# EAGLE design skatemate_proto (EAGLE 7.6.0)

## Sheet 1 of 3
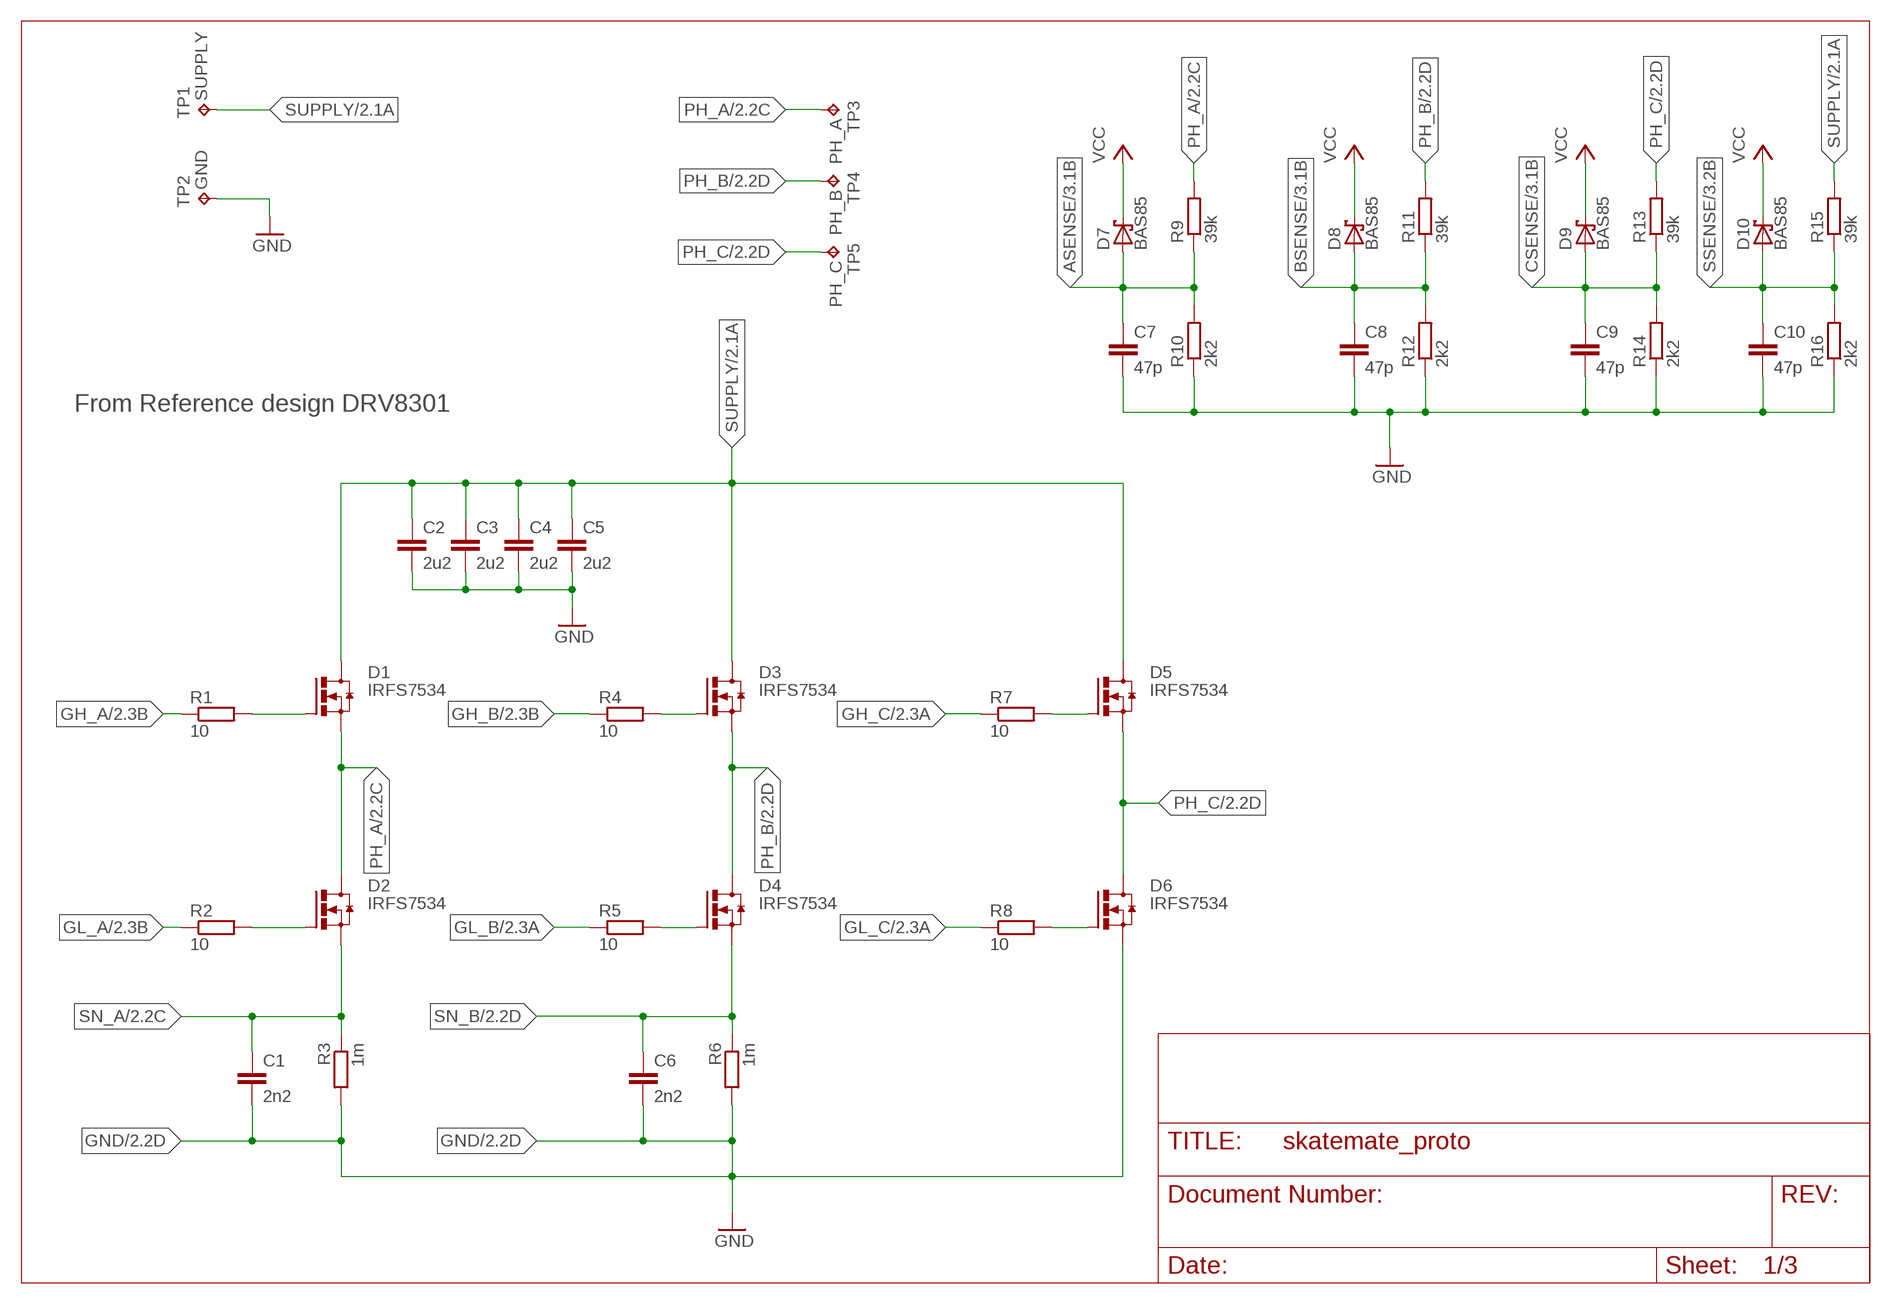
[diagram p0: schematic, sheet 1]

### Parts
C1  2n2  C-EUC0805  [C0805]
C2  2u2  C-EUC1206  [C1206]
C3  2u2  C-EUC1206  [C1206]
C4  2u2  C-EUC1206  [C1206]
C5  2u2  C-EUC1206  [C1206]
C6  2n2  C-EUC0805  [C0805]
C7  47p  C-EUC0805  [C0805]
C8  47p  C-EUC0805  [C0805]
C9  47p  C-EUC0805  [C0805]
C10  47p  C-EUC0805  [C0805]
D1  IRFS7534  [D2PAK-7]
D2  IRFS7534  [D2PAK-7]
D3  IRFS7534  [D2PAK-7]
D4  IRFS7534  [D2PAK-7]
D5  IRFS7534  [D2PAK-7]
D6  IRFS7534  [D2PAK-7]
D7  BAS85  SCHOTTKY-DIODESOD80C  [SOD80C]
D8  BAS85  SCHOTTKY-DIODESOD80C  [SOD80C]
D9  BAS85  SCHOTTKY-DIODESOD80C  [SOD80C]
D10  BAS85  SCHOTTKY-DIODESOD80C  [SOD80C]
R1  10  R-EU_R0805  [R0805]
R2  10  R-EU_R0805  [R0805]
R3  1m  R_EU  [R2512]
R4  10  R-EU_R0805  [R0805]
R5  10  R-EU_R0805  [R0805]
R6  1m  R_EU  [R2512]
R7  10  R-EU_R0805  [R0805]
R8  10  R-EU_R0805  [R0805]
R9  39k  R-EU_R0805  [R0805]
R10  2k2  R-EU_R0805  [R0805]
R11  39k  R-EU_R0805  [R0805]
R12  2k2  R-EU_R0805  [R0805]
R13  39k  R-EU_R0805  [R0805]
R14  2k2  R-EU_R0805  [R0805]
R15  39k  R-EU_R0805  [R0805]
R16  2k2  R-EU_R0805  [R0805]
TP1  SUPPLY  TPSMD_M_1006  [SMD_M_1006]
TP2  GND  TPSMD_M_1006  [SMD_M_1006]
TP3  PH_A  TPSMD_M_1006  [SMD_M_1006]
TP4  PH_B  TPSMD_M_1006  [SMD_M_1006]
TP5  PH_C  TPSMD_M_1006  [SMD_M_1006]

### Nets
ASENSE: C7.1 D7.A R9.1 R10.2 ; also sheet 3
BSENSE: C8.1 D8.A R11.1 R12.2 ; also sheet 3
CSENSE: C9.1 D9.A R13.1 R14.2 ; also sheet 3
GH_A: R1.1 ; also sheet 2
GH_B: R4.1 ; also sheet 2
GH_C: R7.1 ; also sheet 2
GL_A: R2.1 ; also sheet 2
GL_B: R5.1 ; also sheet 2
GL_C: R8.1 ; also sheet 2
GND: C1.2 C2.2 C3.2 C4.2 C5.2 C6.2 C7.2 C8.2 C9.2 C10.2 D6.S1(S) D6.S2(S) D6.S3(S) D6.S4(S) D6.S5(S) R3.2 R6.2 R10.1 R12.1 R14.1 R16.1 TP2.P$1(TP) ; also sheet 2,3
N$7: D1.G R1.2
N$8: D2.G R2.2
N$9: D4.G R5.2
N$10: D3.G R4.2
N$11: D5.G R7.2
N$12: D6.G R8.2
PH_A: D1.S1(S) D1.S2(S) D1.S3(S) D1.S4(S) D1.S5(S) D2.D R9.2 TP3.P$1(TP) ; also sheet 2
PH_B: D3.S1(S) D3.S2(S) D3.S3(S) D3.S4(S) D3.S5(S) D4.D R11.2 TP4.P$1(TP) ; also sheet 2
PH_C: D5.S1(S) D5.S2(S) D5.S3(S) D5.S4(S) D5.S5(S) D6.D R13.2 TP5.P$1(TP) ; also sheet 2
SN_A: C1.1 D2.S1(S) D2.S2(S) D2.S3(S) D2.S4(S) D2.S5(S) R3.1 ; also sheet 2
SN_B: C6.1 D4.S1(S) D4.S2(S) D4.S3(S) D4.S4(S) D4.S5(S) R6.1 ; also sheet 2
SSENSE: C10.1 D10.A R15.1 R16.2 ; also sheet 3
SUPPLY: C2.1 C3.1 C4.1 C5.1 D1.D D3.D D5.D R15.2 TP1.P$1(TP) ; also sheet 2
VCC: D7.C D8.C D9.C D10.C ; also sheet 2,3

### Notes on the sheet
- From Reference design DRV8301

## Sheet 2 of 3
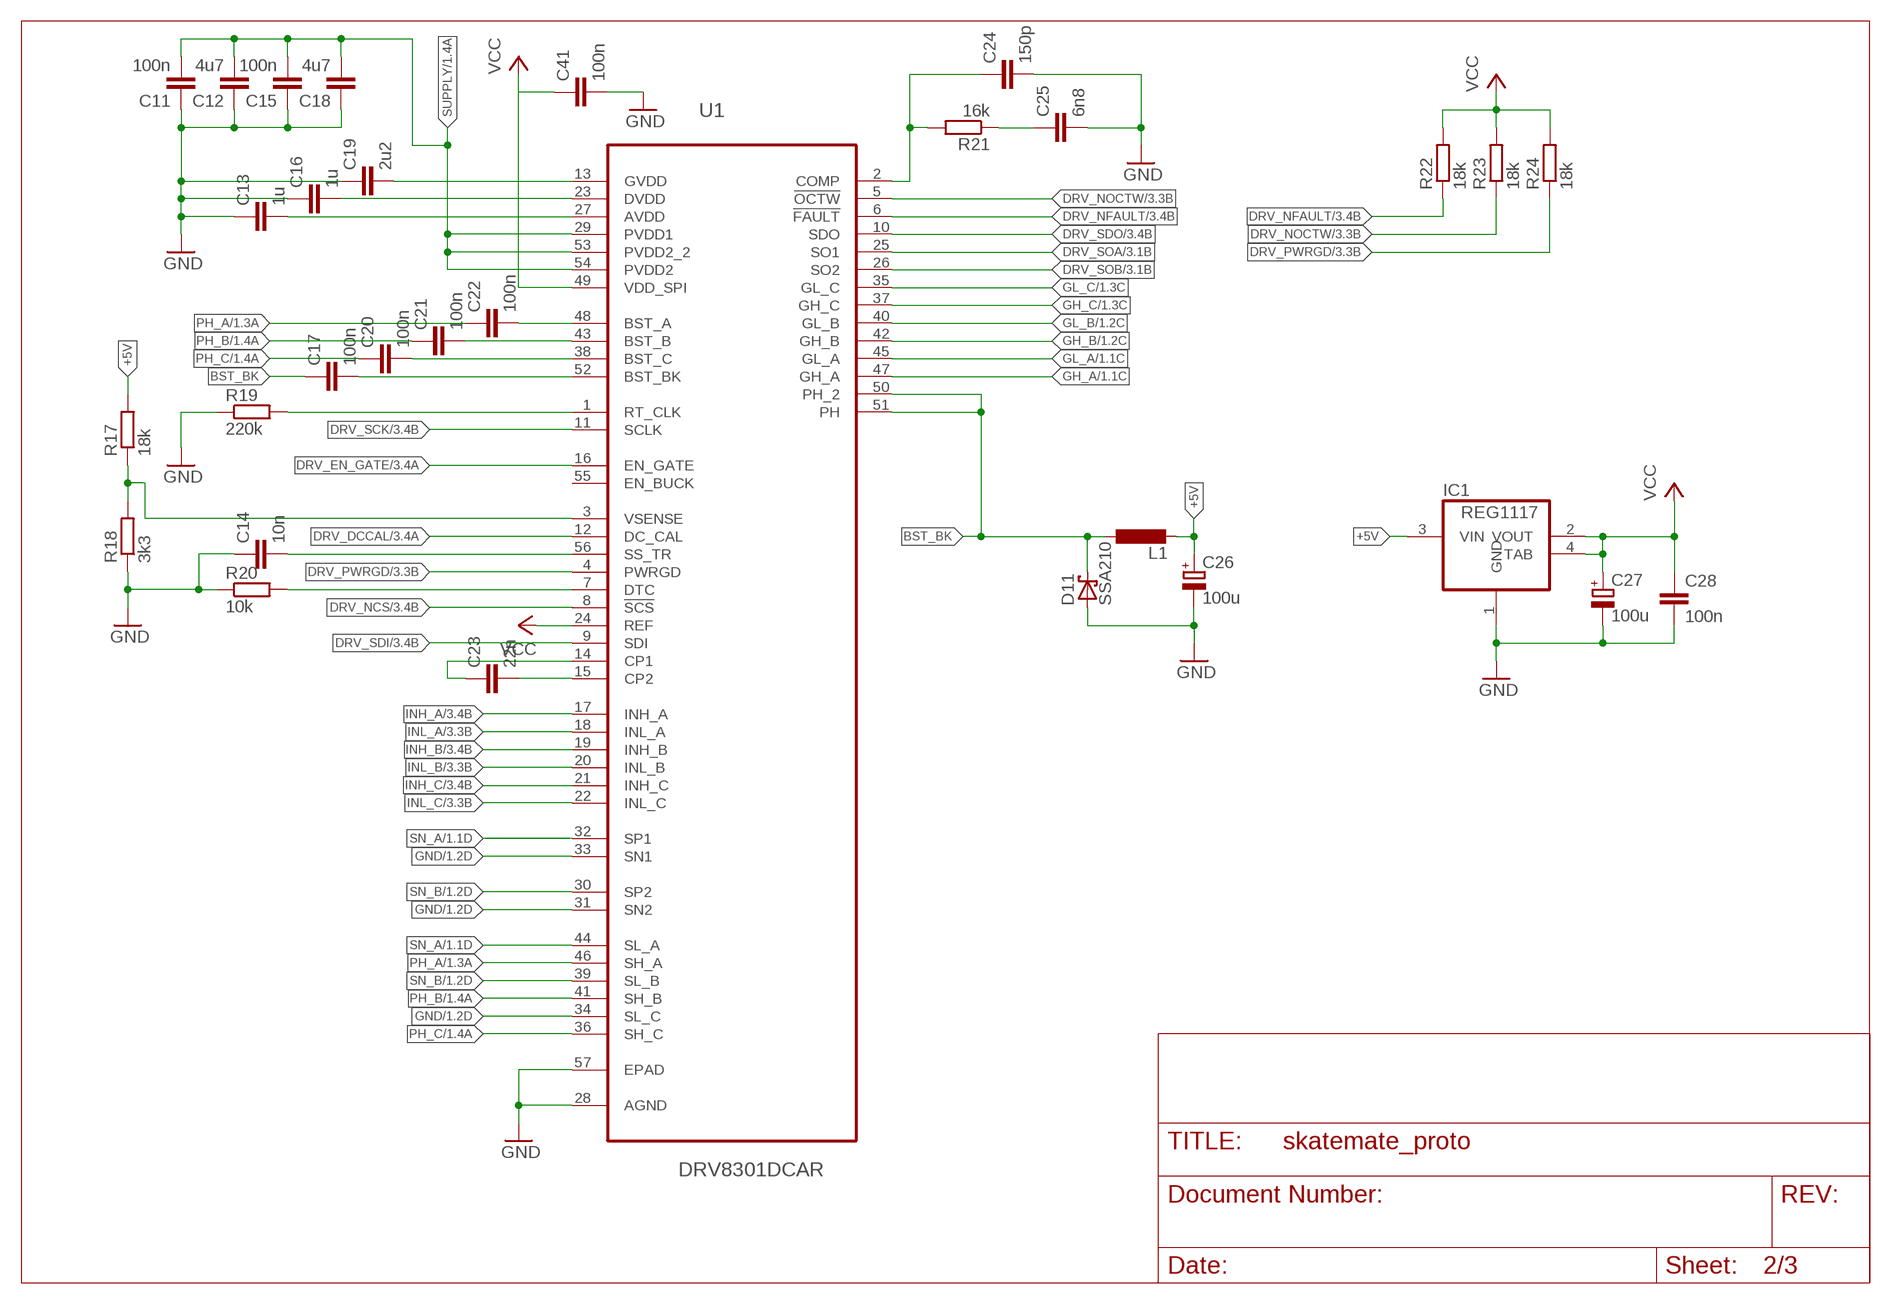
[diagram p1: schematic, sheet 2]

### Parts
C11  100n  C-EUC0805  [C0805]
C12  4u7  C-EUC1206  [C1206]
C13  1u  C-EUC1206  [C1206]
C14  10n  C-EUC0805  [C0805]
C15  100n  C-EUC0805  [C0805]
C16  1u  C-EUC1206  [C1206]
C17  100n  C-EUC0805  [C0805]
C18  4u7  C-EUC1206  [C1206]
C19  2u2  C-EUC1206  [C1206]
C20  100n  C-EUC0805  [C0805]
C21  100n  C-EUC0805  [C0805]
C22  100n  C-EUC0805  [C0805]
C23  22n  C-EUC0805  [C0805]
C24  150p  C-EUC0805  [C0805]
C25  6n8  C-EUC0805  [C0805]
C26  100u  CPOL-EUB/3528-21W  [B/3528-21W]
C27  100u  CPOL-EUB/3528-21W  [B/3528-21W]
C28  100n  C-EUC0805  [C0805]
C41  100n  C-EUC0805  [C0805]
D11  SSA210  SCHOTTKY-DIODEDO-214AA  [DO-214AA]
IC1  REG1117  [SOT223]
L1  L-EUSDR0805  [SDR0805]
R17  18k  R-EU_R0805  [R0805]
R18  3k3  R-EU_R0805  [R0805]
R19  220k  R-EU_R0805  [R0805]
R20  10k  R-EU_R0805  [R0805]
R21  16k  R-EU_R0805  [R0805]
R22  18k  R-EU_R0805  [R0805]
R23  18k  R-EU_R0805  [R0805]
R24  18k  R-EU_R0805  [R0805]
U1  DRV8301DCAR  [SOP50P810X120-57N]

### Nets
+5V: C26.+ IC1.3(VIN) L1.2 R17.2
BST_BK: C17.1 D11.C L1.1 U1.50(PH_2) U1.51(PH)
DRV_DCCAL: U1.12(DC_CAL) ; also sheet 3
DRV_EN_GATE: U1.16(EN_GATE) ; also sheet 3
DRV_NCS: U1.8(!SCS) ; also sheet 3
DRV_NFAULT: R22.1 U1.6(!FAULT) ; also sheet 3
DRV_NOCTW: R23.1 U1.5(!OCTW) ; also sheet 3
DRV_PWRGD: R24.1 U1.4(PWRGD) ; also sheet 3
DRV_SCK: U1.11(SCLK) ; also sheet 3
DRV_SDI: U1.9(SDI) ; also sheet 3
DRV_SDO: U1.10(SDO) ; also sheet 3
DRV_SOA: U1.25(SO1) ; also sheet 3
DRV_SOB: U1.26(SO2) ; also sheet 3
GH_A: U1.47(GH_A) ; also sheet 1
GH_B: U1.42(GH_B) ; also sheet 1
GH_C: U1.37(GH_C) ; also sheet 1
GL_A: U1.45(GL_A) ; also sheet 1
GL_B: U1.40(GL_B) ; also sheet 1
GL_C: U1.35(GL_C) ; also sheet 1
GND: C11.1 C12.1 C13.1 C14.1 C15.1 C16.1 C18.1 C19.1 C24.2 C25.2 C26.- C27.- C28.2 C41.2 D11.A IC1.1(GND) R18.1 R19.1 R20.1 U1.28(AGND) U1.31(SN2) U1.33(SN1) U1.34(SL_C) U1.57(EPAD) ; also sheet 1,3
INH_A: U1.17(INH_A) ; also sheet 3
INH_B: U1.19(INH_B) ; also sheet 3
INH_C: U1.21(INH_C) ; also sheet 3
INL_A: U1.18(INL_A) ; also sheet 3
INL_B: U1.20(INL_B) ; also sheet 3
INL_C: U1.22(INL_C) ; also sheet 3
N$1: C23.2 U1.15(CP2)
N$2: C23.1 U1.14(CP1)
N$3: R20.2 U1.7(DTC)
N$4: R17.1 R18.2 U1.3(VSENSE)
N$5: C14.2 U1.56(SS_TR)
N$6: R19.2 U1.1(RT_CLK)
N$13: C22.2 U1.48(BST_A)
N$14: C21.2 U1.43(BST_B)
N$15: C20.2 U1.38(BST_C)
N$16: C17.2 U1.52(BST_BK)
N$17: C19.2 U1.13(GVDD)
N$18: C16.2 U1.23(DVDD)
N$19: C13.2 U1.27(AVDD)
N$20: C24.1 R21.2 U1.2(COMP)
N$21: C25.1 R21.1
PH_A: C22.1 U1.46(SH_A) ; also sheet 1
PH_B: C21.1 U1.41(SH_B) ; also sheet 1
PH_C: C20.1 U1.36(SH_C) ; also sheet 1
SN_A: U1.32(SP1) U1.44(SL_A) ; also sheet 1
SN_B: U1.30(SP2) U1.39(SL_B) ; also sheet 1
SUPPLY: C11.2 C12.2 C15.2 C18.2 U1.29(PVDD1) U1.53(PVDD2_2) U1.54(PVDD2) ; also sheet 1
VCC: C27.+ C28.1 C41.1 IC1.2(VOUT) IC1.4(TAB) R22.2 R23.2 R24.2 U1.24(REF) U1.49(VDD_SPI) ; also sheet 1,3
Unconnected: U1.55(EN_BUCK)

## Sheet 3 of 3
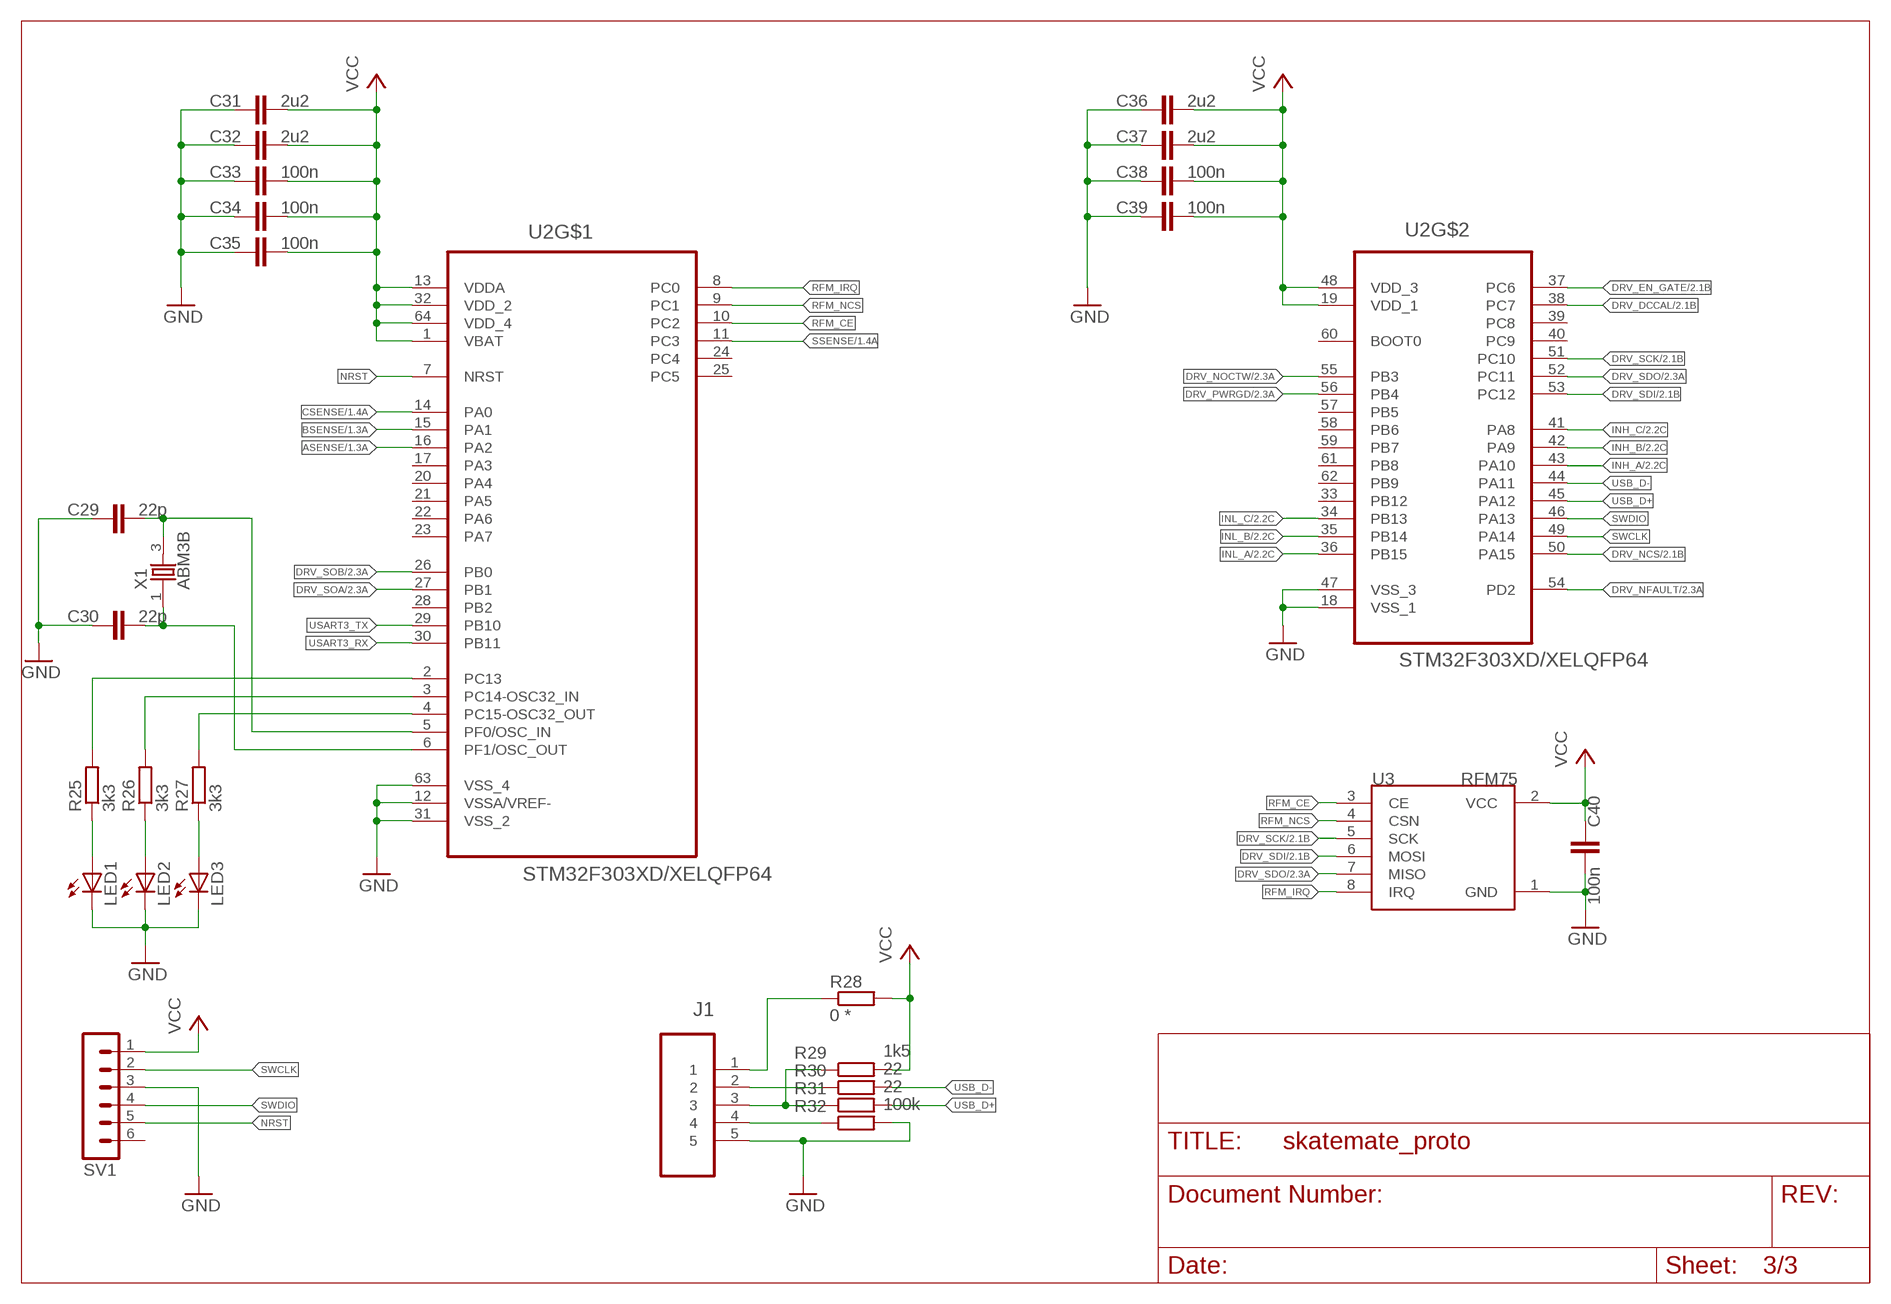
[diagram p2: schematic, sheet 3]

### Parts
C29  22p  C-EUC0805  [C0805]
C30  22p  C-EUC0805  [C0805]
C31  2u2  C-EUC0805  [C0805]
C32  2u2  C-EUC0805  [C0805]
C33  100n  C-EUC0805  [C0805]
C34  100n  C-EUC0805  [C0805]
C35  100n  C-EUC0805  [C0805]
C36  2u2  C-EUC0805  [C0805]
C37  2u2  C-EUC0805  [C0805]
C38  100n  C-EUC0805  [C0805]
C39  100n  C-EUC0805  [C0805]
C40  100n  C-EUC0805  [C0805]
J1  47346-0001  [MOLEX_47346-0001]
LED1  LEDCHIP-LED0805  [CHIP-LED0805]
LED2  LEDCHIP-LED0805  [CHIP-LED0805]
LED3  LEDCHIP-LED0805  [CHIP-LED0805]
R25  3k3  R-EU_R0805  [R0805]
R26  3k3  R-EU_R0805  [R0805]
R27  3k3  R-EU_R0805  [R0805]
R28  0 *  R-EU_R0805  [R0805]
R29  1k5  R-EU_R0805  [R0805]
R30  22  R-EU_R0805  [R0805]
R31  22  R-EU_R0805  [R0805]
R32  100k  R-EU_R0805  [R0805]
SV1  MA06-1  [MA06-1]
U2  STM32F303XD/XELQFP64  [LQFP64]
U3  RFM75  [RFM75]
X1  ABM3B  [IQG5032B]

### Nets
ASENSE: U2.16(PA2) ; also sheet 1
BSENSE: U2.15(PA1) ; also sheet 1
CSENSE: U2.14(PA0) ; also sheet 1
DRV_DCCAL: U2.38(PC7) ; also sheet 2
DRV_EN_GATE: U2.37(PC6) ; also sheet 2
DRV_NCS: U2.50(PA15) ; also sheet 2
DRV_NFAULT: U2.54(PD2) ; also sheet 2
DRV_NOCTW: U2.55(PB3) ; also sheet 2
DRV_PWRGD: U2.56(PB4) ; also sheet 2
DRV_SCK: U2.51(PC10) U3.5(SCK) ; also sheet 2
DRV_SDI: U2.53(PC12) U3.6(MOSI) ; also sheet 2
DRV_SDO: U2.52(PC11) U3.7(MISO) ; also sheet 2
DRV_SOA: U2.27(PB1) ; also sheet 2
DRV_SOB: U2.26(PB0) ; also sheet 2
GND: C29.1 C30.1 C31.1 C32.1 C33.1 C34.1 C35.1 C36.1 C37.1 C38.1 C39.1 C40.2 J1.5 LED1.C LED2.C LED3.C R32.2 SV1.3 U2.12(VSSA/VREF-) U2.18(VSS_1) U2.31(VSS_2) U2.47(VSS_3) U2.63(VSS_4) U3.1(GND) ; also sheet 1,2
INH_A: U2.43(PA10) ; also sheet 2
INH_B: U2.42(PA9) ; also sheet 2
INH_C: U2.41(PA8) ; also sheet 2
INL_A: U2.36(PB15) ; also sheet 2
INL_B: U2.35(PB14) ; also sheet 2
INL_C: U2.34(PB13) ; also sheet 2
N$22: J1.4 R32.1
N$23: J1.3 R29.1 R31.1
N$24: J1.2 R30.1
N$25: J1.1 R28.1
N$28: R27.2 U2.4(PC15-OSC32_OUT)
N$29: R26.2 U2.3(PC14-OSC32_IN)
N$30: R25.2 U2.2(PC13)
N$31: LED1.A R25.1
N$32: LED2.A R26.1
N$33: LED3.A R27.1
N$35: C30.2 U2.6(PF1/OSC_OUT) X1.1
N$36: C29.2 U2.5(PF0/OSC_IN) X1.3
NRST: SV1.5 U2.7(NRST)
RFM_CE: U2.10(PC2) U3.3(CE)
RFM_IRQ: U2.8(PC0) U3.8(IRQ)
RFM_NCS: U2.9(PC1) U3.4(CSN)
SSENSE: U2.11(PC3) ; also sheet 1
SWCLK: SV1.2 U2.49(PA14)
SWDIO: SV1.4 U2.46(PA13)
USART3_RX: U2.30(PB11)
USART3_TX: U2.29(PB10)
USB_D+: R31.2 U2.45(PA12)
USB_D-: R30.2 U2.44(PA11)
VCC: C31.2 C32.2 C33.2 C34.2 C35.2 C36.2 C37.2 C38.2 C39.2 C40.1 R28.2 R29.2 SV1.1 U2.1(VBAT) U2.13(VDDA) U2.19(VDD_1) U2.32(VDD_2) U2.48(VDD_3) U2.64(VDD_4) U3.2(VCC) ; also sheet 1,2
Unconnected: SV1.6 U2.17(PA3) U2.20(PA4) U2.21(PA5) U2.22(PA6) U2.23(PA7) U2.24(PC4) U2.25(PC5) U2.28(PB2) U2.33(PB12) U2.39(PC8) U2.40(PC9) U2.57(PB5) U2.58(PB6) U2.59(PB7) U2.60(BOOT0) U2.61(PB8) U2.62(PB9)

## Library data of the parts
C1-C25 C28-C41 = skatemate:C-EU: CAPACITOR, European symbol
C26 C27 = skatemate:CPOL-EU: POLARIZED CAPACITOR, European symbol
D1-D6 = skatemate:IRFS7534
D7-D11 = skatemate:SCHOTTKY-DIODE: Schottky Diode
IC1 = skatemate:REG1117: 800mA and 1A Low Dropout (LDO) Positive Regulator 1.8V, 2.5V, 2.85V, 3.3V, 5V, and Adj; MPN: REG1117; OC_FARNELL: 1097566; OC_NEWARK: 14P6981
J1 = skatemate:47346-0001: CONN RCPT 5POS MICRO USB R/A SMD; MPN: 47346-0001; OC_FARNELL: 1568026; OC_NEWARK: 47M0505; PACKAGE: 5 POS MICRO USB R/A; SUPPLIER: MOLEX
L1 = skatemate:L-EU: INDUCTOR, European symbol
LED1-LED3 = skatemate:LED: LED OSRAM: - CHIPLED LG R971, LG N971, LY N971, LG Q971, LY Q971, LO R971, LY R971 LH N974, LH R974 LS Q976, LO Q976, LY Q976 LO Q996 - Hyper CHIPLED LW Q18S LB Q993, LB Q99A, LB R99A - SideLED LS A670, LO A670, LY A670, LG A670, LP A670 LB A673, LV A673, LT A673, LW A673 LH A674 LY A675 LS A676, LA A676, LO A676, LY A676, LW A676 LS A679, LY A679, LG A679 - Hyper Micro SIDELED® LS Y876, LA Y876, LO Y876, LY Y876 LT Y87S - SmartLED LW L88C, LW L88S LB L89C, LB L89S, LG L890 LS L89K, LO L89K, LY L89K LS L896, LA L896, LO L896, LY L896 - TOPLED LS T670, LO T670, LY T670, LG T670, LP T670 LSG T670, LSP T670, LSY T670, LOP T670, LYG T670 LG T671, LOG T671, LSG T671 LB T673, LV T673, LT T673, LW T673 LH T674 LS T676, LA T676, LO T676, LY T676, LB T676, LH T676, LSB T676, LW T676 LB T67C, LV T67C, LT T67C, LS T67K, LO T67K, LY T67K, LW E67C LS E67B, LA E67B, LO E67B, LY E67B, LB E67C, LV E67C, LT E67C LW T67C LS T679, LY T679, LG T679 LS T770, LO T770, LY T770, LG T770, LP T770 LB T773, LV T773, LT T773, LW T773 LH T774 LS E675, LA E675, LY E675, LS T675 LS T776, LA T776, LO T776, LY T776, LB T776 LHGB T686 LT T68C, LB T68C - Hyper Mini TOPLED® LB M676 - Mini TOPLED Santana® LG M470 LS M47K, LO M47K, LY M47K Source: http://www.osram.convergy.de LUXEON: - LUMILED® LXK2-PW12-R00, LXK2-PW12-S00, LXK2-PW14-U00, LXK2-PW14-V00 LXK2-PM12-R00, LXK2-PM12-S00, LXK2-PM14-U00 LXK2-PE12-Q00, LXK2-PE12-R00, LXK2-PE12-S00, LXK2-PE14-T00, LXK2-PE14-U00 LXK2-PB12-K00, LXK2-PB12-L00, LXK2-PB12-M00, LXK2-PB14-N00, LXK2-PB14-P00, LXK2-PB14-Q00 LXK2-PR12-L00, LXK2-PR12-M00, LXK2-PR14-Q00, LXK2-PR14-R00 LXK2-PD12-Q00, LXK2-PD12-R00, LXK2-PD12-S00 LXK2-PH12-R00, LXK2-PH12-S00 LXK2-PL12-P00, LXK2-PL12-Q00, LXK2-PL12-R00 Source: www.luxeon.com KINGBRIGHT: KA-3528ASYC Source: www.kingbright.com
R1 R2 R4 R5 R7-R32 = skatemate:R-EU_: RESISTOR, European symbol
R3 R6 = skatemate:R_EU
SV1 = skatemate:MA06-1: PIN HEADER; OC_FARNELL: unknown; OC_NEWARK: unknown
TP1-TP5 = skatemate:TP: Test pad
U1 = skatemate:DRV8301DCAR: Three Phase Pre-Driver with Dual Current Shunt Amplifiers and Buck Regulator,HTSSOP-56; MPN: DRV8301DCAR; OC_FARNELL: 2045285; OC_NEWARK: 64T2938; PACKAGE: HTSSOP-56; SUPPLIER: TEXAS INSTRUMENTS
U2 = skatemate:STM32F303XD/XE
U3 = skatemate:RFM75
X1 = skatemate:ABM3B

## Board
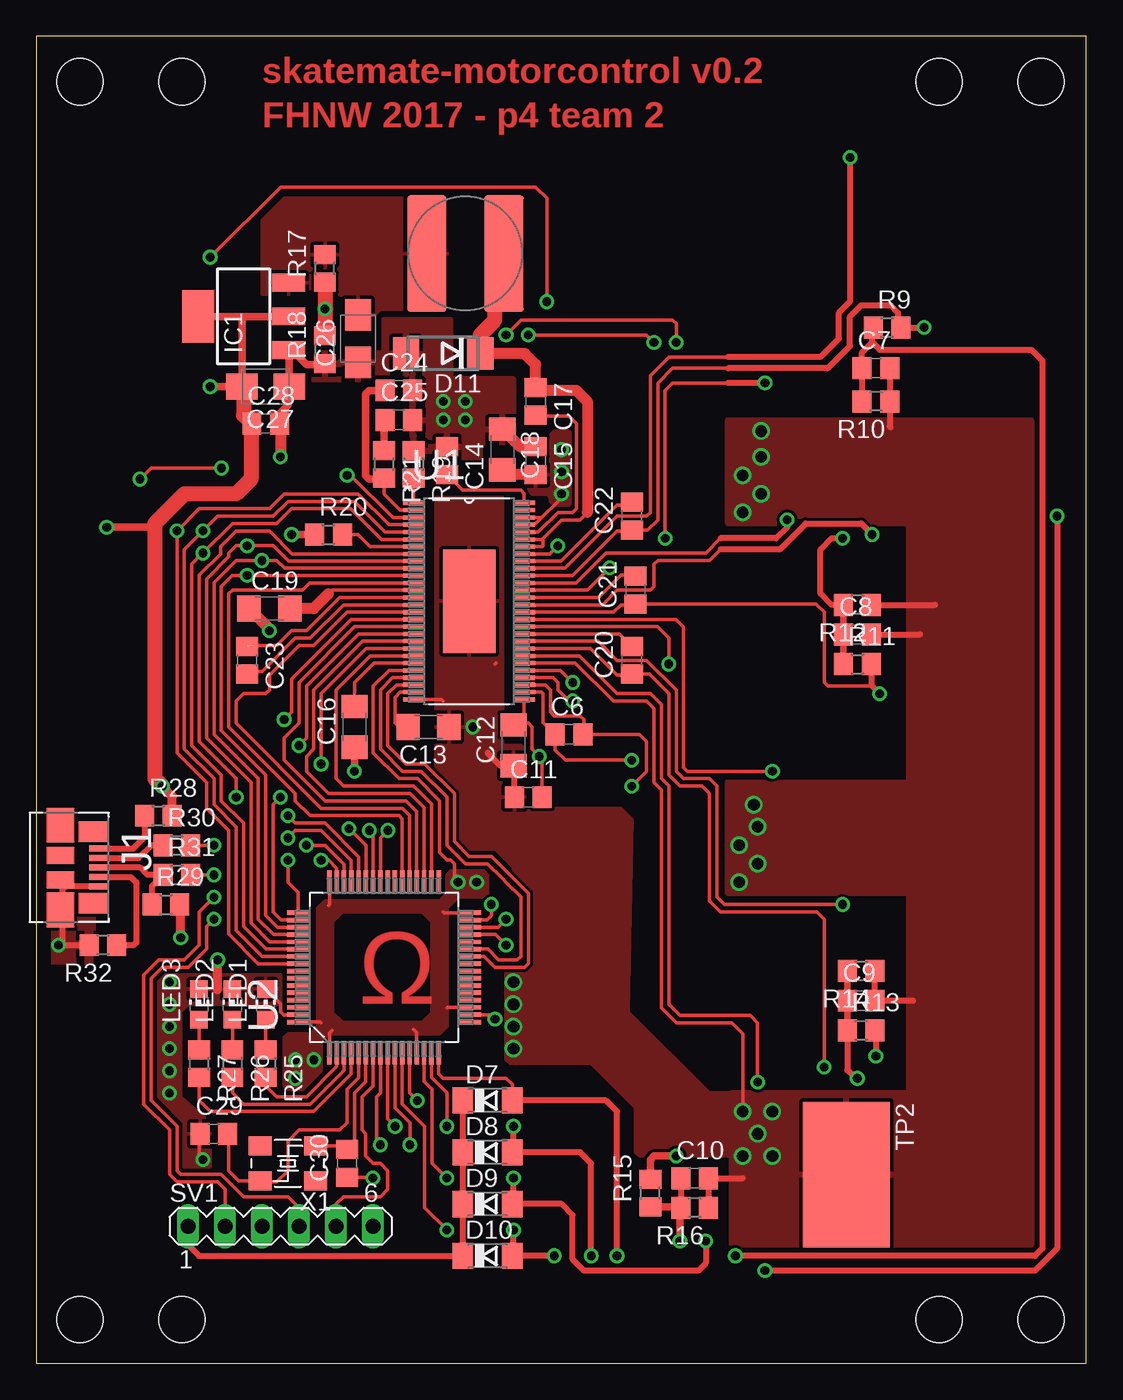
[diagram p3: board, top side]
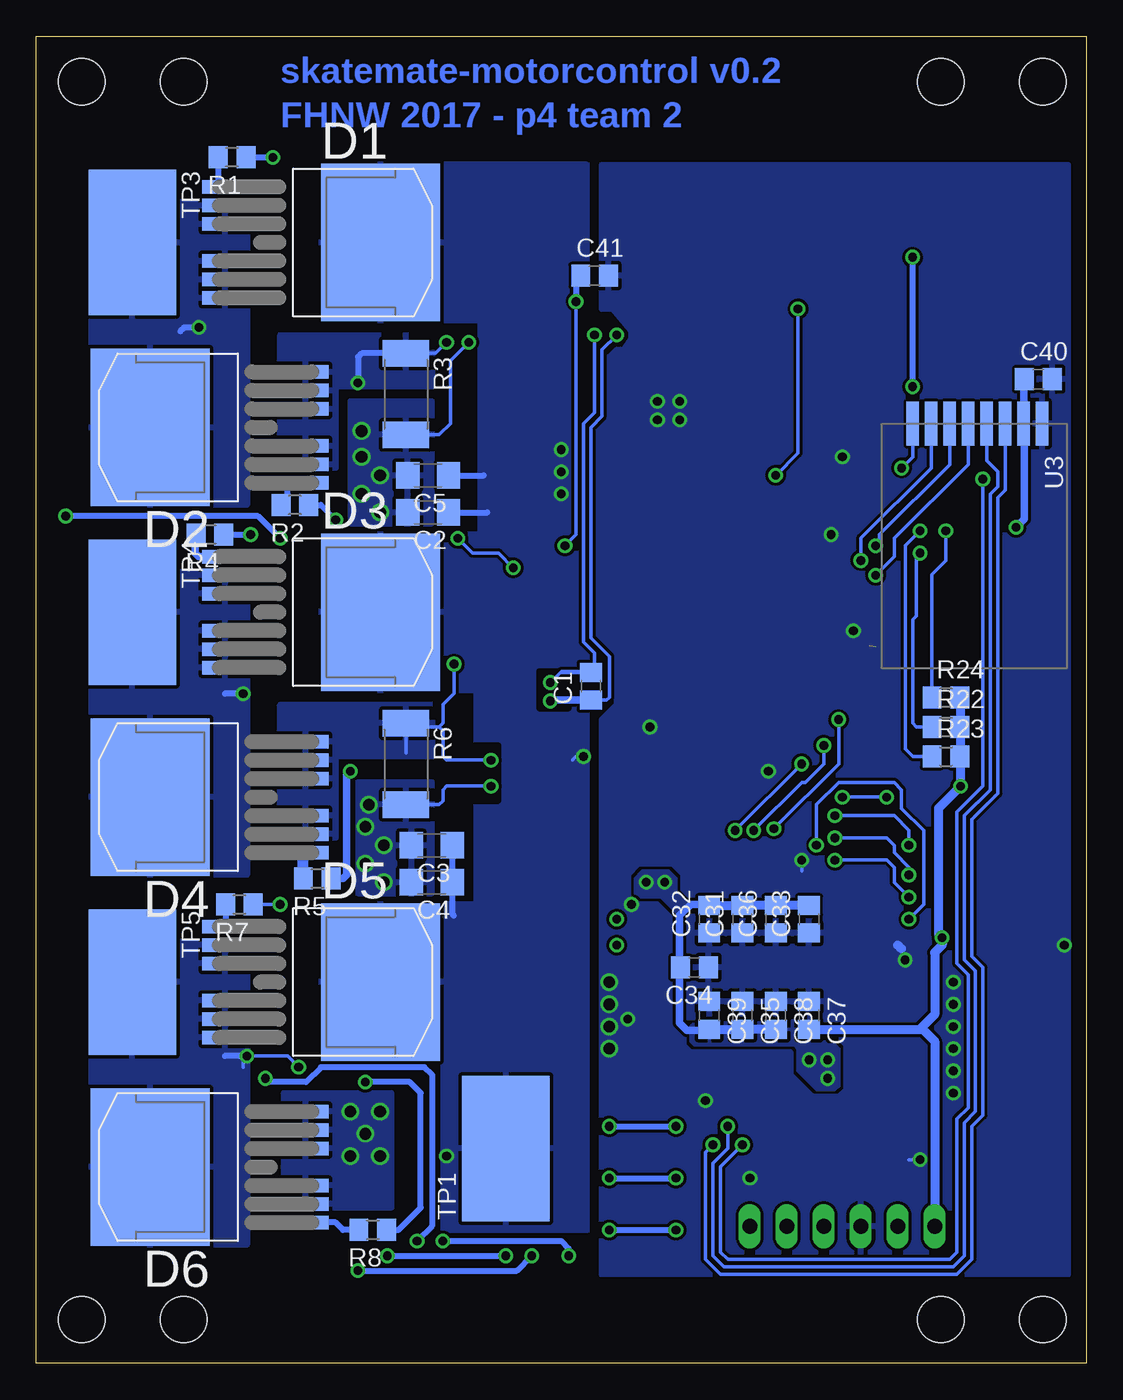
[diagram p4: board, bottom side, seen from below]

Size 72.12 x 91.11 mm. Coordinates in mm from the lower left corner, seen from the top.
Outline: 0,0 72.12,0 72.12,91.11 0,91.11 0,0
Copper layers (1*16): Top 0.035mm / dielectric 1.5mm / Bottom 0.035mm
Design rules "default *": minimum track width 10mil, minimum drill 12mil, track to track 8mil, track to pad 8mil, pad to pad 8mil, via to via 8mil, smd to smd 8mil, copper to edge 40mil, drill to drill 8mil, minimum pad ring 10mil, minimum via ring 8mil, stop-mask expansion 4mil, vias tented up to drill 0mil, thermal gap 10mil
Holes 3.17 mm at 3,88 10,88 62,88 69,88 10,3 62,3 69,3 3,3

### Footprints (pad centres in the part's own frame; a part is rotated, then mirrored left to right if it is on the bottom)
C0805 = smd 1.3 x 1.5: 1 -0.95,0; 2 0.95,0
C1206 = smd 1.6 x 1.8: 1 -1.4,0; 2 1.4,0
B/3528-21W = smd 2.15 x 1.8: + 1.625,0; - -1.625,0
D2PAK-7 = smd 10.8 x 8.15: D 0,4.1 | smd 0.9 x 3.2: G -3.81,-6.56; S1 -2.54,-6.56; S2 -1.27,-6.56; S3 1.27,-6.56; S4 2.54,-6.56; S5 3.81,-6.56
SOD80C = smd 1.4 x 1.8: A 1.7,0; C -1.7,0
DO-214AA = smd 1.8 x 2.2: A 2.55,0; C -2.55,0
SOT223 = smd 1.219 x 2.235: 1 -2.311,-3.099; 2 0,-3.099; 3 2.311,-3.099 | smd 3.6 x 2.2: 4 0,3.099
MOLEX_47346-0001 = smd 0.395 x 1.38: 1 -1.3,0; 2 -0.65,0; 3 0,0; 4 0.65,0; 5 1.3,0 | smd 1.4 x 2.1: M1 -2.462,-0.36; M2 2.462,-0.36 | smd 2.375 x 1.9: M3 -2.913,-2.66; M6 2.913,-2.66 | smd 1.175 x 1.9: M4 -0.82,-2.66; M5 0.85,-2.66
SDR0805 = smd 8 x 2.7: 1 0,2.65; 2 0,-2.65
CHIP-LED0805 = smd 1.2 x 1.2: A 0,-1.05; C 0,1.05
R0805 = smd 1.3 x 1.5: 1 -0.95,0; 2 0.95,0
R2512 = smd 1.8 x 3.2: 1 -2.8,0; 2 2.8,0
MA06-1 = drill 1.016 long: 1 -6.35,0; 2 -3.81,0; 3 -1.27,0; 4 1.27,0; 5 3.81,0; 6 6.35,0
SMD_M_1006 = smd 10 x 6: P$1 0,0
SOP50P810X120-57N = smd 1.473 x 0.279: 1 -3.785,6.756; 2 -3.785,6.248; 3 -3.785,5.74; 4 -3.785,5.258; 5 -3.785,4.75; 6 -3.785,4.242; 7 -3.785,3.759; 8 -3.785,3.251; 9 -3.785,2.743; 10 -3.785,2.261; 11 -3.785,1.753; 12 -3.785,1.245; 13 -3.785,0.762; 14 -3.785,0.254; 15 -3.785,-0.254; 16 -3.785,-0.762; 17 -3.785,-1.245; 18 -3.785,-1.753; 19 -3.785,-2.261; 20 -3.785,-2.743; 21 -3.785,-3.251; 22 -3.785,-3.759; 23 -3.785,-4.242; 24 -3.785,-4.75; 25 -3.785,-5.258; 26 -3.785,-5.74; 27 -3.785,-6.248; 28 -3.785,-6.756; 29 3.785,-6.756; 30 3.785,-6.248; 31 3.785,-5.74; 32 3.785,-5.258; 33 3.785,-4.75; 34 3.785,-4.242; 35 3.785,-3.759; 36 3.785,-3.251; 37 3.785,-2.743; 38 3.785,-2.261; 39 3.785,-1.753; 40 3.785,-1.245; 41 3.785,-0.762; 42 3.785,-0.254; 43 3.785,0.254; 44 3.785,0.762; 45 3.785,1.245; 46 3.785,1.753; 47 3.785,2.261; 48 3.785,2.743; 49 3.785,3.251; 50 3.785,3.759; 51 3.785,4.242; 52 3.785,4.75; 53 3.785,5.258; 54 3.785,5.74; 55 3.785,6.248; 56 3.785,6.756 | smd 3.607 x 7.112: 57 0,0
LQFP64 = smd 1.5 x 0.3: 1 -5.9,3.75; 2 -5.9,3.25; 3 -5.9,2.75; 4 -5.9,2.25; 5 -5.9,1.75; 6 -5.9,1.25; 7 -5.9,0.75; 8 -5.9,0.25; 9 -5.9,-0.25; 10 -5.9,-0.75; 11 -5.9,-1.25; 12 -5.9,-1.75; 13 -5.9,-2.25; 14 -5.9,-2.75; 15 -5.9,-3.25; 16 -5.9,-3.75; 33 5.9,-3.75; 34 5.9,-3.25; 35 5.9,-2.75; 36 5.9,-2.25; 37 5.9,-1.75; 38 5.9,-1.25; 39 5.9,-0.75; 40 5.9,-0.25; 41 5.9,0.25; 42 5.9,0.75; 43 5.9,1.25; 44 5.9,1.75; 45 5.9,2.25; 46 5.9,2.75; 47 5.9,3.25; 48 5.9,3.75 | smd 0.3 x 1.5: 17 -3.75,-5.9; 18 -3.25,-5.9; 19 -2.75,-5.9; 20 -2.25,-5.9; 21 -1.75,-5.9; 22 -1.25,-5.9; 23 -0.75,-5.9; 24 -0.25,-5.9; 25 0.25,-5.9; 26 0.75,-5.9; 27 1.25,-5.9; 28 1.75,-5.9; 29 2.25,-5.9; 30 2.75,-5.9; 31 3.25,-5.9; 32 3.75,-5.9; 49 3.75,5.9; 50 3.25,5.9; 51 2.75,5.9; 52 2.25,5.9; 53 1.75,5.9; 54 1.25,5.9; 55 0.75,5.9; 56 0.25,5.9; 57 -0.25,5.9; 58 -0.75,5.9; 59 -1.25,5.9; 60 -1.75,5.9; 61 -2.25,5.9; 62 -2.75,5.9; 63 -3.25,5.9; 64 -3.75,5.9
RFM75 = smd 3 x 0.85: 1 0,0; 2 0,-1.27; 3 0,-2.54; 4 0,-3.81; 5 0,-5.08; 6 0,-6.35; 7 0,-7.62; 8 0,-8.89
IQG5032B = smd 1.6 x 1.3: 1 -1.9,-1.2; 2 1.9,-1.2; 3 1.9,1.2; 4 -1.9,1.2

### Placement (x,y rotation side)
C1  34.04,46.48 90 bottom
C2  45.21,58.42 180 bottom
C3  44.96,35.56 180 bottom
C4  44.96,33.02 180 bottom
C5  45.21,60.96 180 bottom
C6  36.58,43.18 0 top
C7  57.66,68.33 0 top
C8  56.39,50.04 0 top
C9  56.64,24.89 0 top
C10  45.21,12.7 0 top
C11  33.78,38.86 0 top
C12  32.77,42.42 90 top
C13  26.92,43.69 180 top
C14  28.19,61.98 270 top
C15  34.29,61.98 270 top
C16  21.84,43.69 90 top
C17  34.29,66.04 270 top
C18  32,62.74 270 top
C19  16,51.82 0 top
C20  40.89,48.26 90 top
C21  41.15,53.09 90 top
C22  40.89,58.17 90 top
C23  14.48,48.26 270 top
C24  24.89,66.8 0 top
C25  24.89,64.77 0 top
C26  22.1,70.36 90 top
C27  15.75,67.06 180 top
C28  15.75,64.52 0 top
C29  12.19,15.75 0 top
C30  21.34,13.72 90 top
C31  23.62,30.48 90 bottom
C32  25.91,30.48 90 bottom
C33  19.05,30.48 90 bottom
C34  26.92,27.18 180 bottom
C35  23.62,23.88 270 bottom
C36  21.34,30.48 90 bottom
C37  19.05,23.88 270 bottom
C38  21.34,23.88 270 bottom
C39  25.91,23.88 270 bottom
C40  3.3,67.56 0 bottom
C41  33.78,74.68 0 bottom
D1  52.58,76.96 270 bottom
D2  60.2,64.26 90 bottom
D3  52.58,51.56 270 bottom
D4  60.2,38.86 90 bottom
D5  52.58,26.16 270 bottom
D6  60.2,13.46 90 bottom
D7  30.99,18.03 0 top
D8  30.99,14.48 0 top
D9  30.99,10.92 0 top
D10  30.99,7.37 0 top
D11  27.94,69.34 180 top
IC1  14.22,71.88 90 top
J1  4.32,34.04 270 top
L1  29.46,76.2 270 top
LED1  15.75,24.64 0 top
LED2  13.46,24.64 0 top
LED3  11.18,24.64 0 top
R1  58.67,82.8 180 bottom
R2  54.36,58.93 180 bottom
R3  46.74,66.55 270 bottom
R4  60.2,56.9 180 bottom
R5  52.83,33.27 180 bottom
R6  46.74,41.15 270 bottom
R7  58.17,31.5 180 bottom
R8  49.02,9.14 180 bottom
R9  58.42,71.12 0 top
R10  57.66,66.04 180 top
R11  56.39,48.01 0 top
R12  56.39,52.07 180 top
R13  56.64,22.86 0 top
R14  56.64,26.92 180 top
R15  42.16,11.68 90 top
R16  45.21,10.67 180 top
R17  19.81,75.18 90 top
R18  19.81,69.6 90 top
R19  25.91,61.72 270 top
R20  20.07,56.9 0 top
R21  23.88,61.72 270 top
R22  9.65,43.69 0 bottom
R23  9.65,41.66 0 bottom
R24  9.65,45.72 0 bottom
R25  15.75,20.57 270 top
R26  13.46,20.57 270 top
R27  11.18,20.57 270 top
R28  8.38,37.59 0 top
R29  8.89,31.5 0 top
R30  9.65,35.56 0 top
R31  9.65,33.53 0 top
R32  4.57,28.7 180 top
SV1  16.76,9.4 0 top
TP1  39.88,14.73 90 bottom
TP2  55.63,12.95 270 top
TP3  65.53,76.96 270 bottom
TP4  65.53,51.56 270 bottom
TP5  65.53,26.16 270 bottom
U1  29.72,52.32 0 top
U2  23.88,27.18 90 top
U3  3.05,64.52 270 bottom
X1  17.27,13.72 180 top

### Tracks (layer width: path | path; a pad name or v marks a point on that pad's centre or on a via)
+5V
  pour Top: 27.94,80.01 17.02,80.01 15.49,78.49 15.49,73.41 20.83,73.41 21.34,72.9 21.34,71.12 23.11,71.12 23.11,71.88 23.62,72.39 27.94,72.39 28.19,72.64 28.19,79.76
ASENSE  (via drill 0.6)
  Top 0.254: D7.A 32.69,19.13 32.26,19.56 27.94,19.56 27.63,19.87 U2.16
  Top 0.406: 57.4,70.1 56.71,69.41 C7.1 R10.2 | 57.4,70.1 57.4,71.05 R9.1 | 57.4,70.1 57.91,69.6 68.33,69.6 69.09,68.83 69.09,7.87 68.58,7.37 v48.01,7.37 | v39.88,7.37 39.88,17.27 39.12,18.03 D7.A
  Bottom 0.406: v48.01,7.37 v39.88,7.37
BSENSE  (via drill 0.6)
  Top 0.254: U2.15 27.13,19.61 28.19,18.54 v28.19,16.26
  Top 0.406: R12.2 C8.1 R11.1 55.44,52 55.37,52.07 54.61,52.07 53.85,52.83 53.85,55.88 54.61,56.64 v55.37,56.64 | v70.1,58.17 70.1,7.87 68.58,6.35 v50.04,6.35 | v38.1,7.37 38.1,13.72 37.34,14.48 32.77,14.48 | D8.A 32.77,14.48 | 32.77,14.48 v32.77,16.26
  Bottom 0.406: v55.37,56.64 56.9,58.17 v70.1,58.17 | v50.04,6.35 39.12,6.35 v38.1,7.37 | v32.77,16.26 v28.19,16.26
BST_BK
  Top 0.254: U1.51 34.72,56.57 | U1.50 34.75,56.08 34.8,56.13 34.8,56.49 34.72,56.57 | 34.72,56.57 36.07,57.91 37.34,57.91 37.85,58.42
  Top 0.762: 37.85,58.42 37.85,66.04 37.08,66.8 34.48,66.8 C17.1 34.29,68.58 33.53,69.34 D11.C
  Top 1.016: D11.C 30.49,70.62 31.5,71.63 31.5,75.58 L1.1
CSENSE  (via drill 0.6)
  Top 0.254: U2.14 26.63,19.35 27.18,18.8 27.18,13.72 v28.19,12.7
  Top 0.406: R14.2 C9.1 R13.1 | R13.1 55.69,26.86 55.63,26.92 | R13.1 55.69,20.13 56.27,19.56 v56.39,19.56 | v45.97,8.38 45.97,6.86 45.47,6.35 37.59,6.35 36.83,7.11 36.83,10.16 36.07,10.92 D9.A 32.77,10.92 v32.77,12.7
  Bottom 0.406: v32.77,12.7 v28.19,12.7 | v56.39,19.56 56.13,19.3 53.59,19.3 52.58,20.32 45.47,20.32 44.96,19.81 44.96,9.4 v45.97,8.38
DRV_DCCAL
  Top 0.254: U2.38 25.13,37.36 24.89,37.59 18.8,37.59 17.78,38.61 17.78,39.12 13.21,43.69 13.21,52.83 13.46,53.09 18.29,53.09 18.77,53.57 U1.12
DRV_EN_GATE
  Top 0.254: U2.37 25.63,37.62 25.15,38.1 19.56,38.1 13.72,43.94 13.72,45.47 14.22,45.97 15.75,45.97 16,46.23 16,47.24 18.03,49.28 19.05,49.28 21.34,51.56 U1.16
DRV_NCS  (via drill 0.6)
  Top 0.254: U2.50 16.82,30.43 16.26,30.99 16.26,38.35 v16.76,38.86 | U1.8 17.58,55.58 16,57.15 13.72,57.15 12.65,56.08 12.65,55.58 11.18,54.1 11.18,42.67 13.72,40.13 v13.72,38.86
  Bottom 0.254: v13.72,38.86 v16.76,38.86
DRV_NFAULT  (via drill 0.6)
  Top 0.254: U1.6 23.7,56.57 21.59,58.67 17.53,58.67 16.51,57.66 13.46,57.66 v11.43,55.63 10.67,54.86 10.67,42.42 12.7,40.39 12.7,38.61 14.22,37.08 14.22,29.97 15.77,28.43 U2.54
  Bottom 0.254: v11.43,55.63 11.68,55.37 11.68,51.31 11.94,51.05 11.94,43.94 11.68,43.69 R22.1
DRV_NOCTW  (via drill 0.6)
  Top 0.254: U1.5 23.95,57.07 21.84,59.18 17.27,59.18 16.26,58.17 12.45,58.17 v11.43,57.15 10.16,55.88 10.16,42.16 12.19,40.13 12.19,38.35 13.72,36.83 13.72,29.72 15.51,27.93 U2.55
  Bottom 0.254: v11.43,57.15 12.45,56.13 12.45,42.16 11.94,41.66 R23.1
DRV_PWRGD  (via drill 0.6)
  Top 0.254: U1.4 24.21,57.58 22.1,59.69 17.02,59.69 16,58.67 11.18,58.67 v9.65,57.15 9.65,41.91 11.68,39.88 11.68,38.1 13.21,36.58 13.21,29.46 15.24,27.43 U2.56
  Bottom 0.254: v9.65,57.15 9.65,55.12 10.6,54.17 R24.1
DRV_SCK  (via drill 0.6)
  Top 0.254: U2.51 16.55,29.93 15.75,30.73 15.75,40.39 12.7,43.43 12.7,53.34 13.44,54.08 14.45,54.08 v14.48,54.1 14.5,54.08 U1.11
  Bottom 0.254: U3.5 8.13,61.72 13.21,56.64 13.21,55.37 v14.48,54.1
DRV_SDI  (via drill 0.6)
  Top 0.254: U2.53 16.03,28.93 14.73,30.23 14.73,39.88 11.68,42.93 11.68,53.85 13.21,55.37 13.21,55.63 13.72,56.13 v14.48,56.13 16.26,56.13 17.32,55.07 U1.9
  Bottom 0.254: U3.6 9.4,61.72 14.22,56.9 14.22,56.39 v14.48,56.13
DRV_SDO  (via drill 0.6)
  Top 0.254: U2.52 16.29,29.43 15.24,30.48 15.24,40.13 12.19,43.18 12.19,53.59 13.72,55.12 v15.49,55.12 16.51,55.12 17.04,54.59 U1.10
  Bottom 0.254: U3.7 10.67,61.47 15.49,56.64 v15.49,55.12
DRV_SOA
  Top 0.254: U1.25 24.46,47.07 23.62,46.23 23.62,42.16 25.15,40.64 26.42,40.64 28.19,38.86 28.19,35.56 29.46,34.29 30.99,34.29 32,33.27 32.26,33.02 33.27,32 33.27,27.94 33.02,27.69 31.75,27.69 31.01,28.43 U2.27
DRV_SOB
  Top 0.254: U1.26 24.74,46.58 24.13,45.97 24.13,42.42 25.4,41.15 26.67,41.15 28.7,39.12 28.7,35.81 29.72,34.8 31.24,34.8 33.78,32.26 33.78,27.43 33.53,27.18 31.5,27.18 30.75,27.93 U2.26
GH_A  (via drill 0.6)
  Top 0.254: U1.47 36.3,54.59 39.88,58.17 41.91,58.17 42.16,58.42 42.16,67.82 43.43,69.09 47.5,69.09
  Top 0.406: v55.88,82.8 55.88,72.9 55.12,72.14 55.12,70.36 53.85,69.09 47.5,69.09
  Bottom 0.406: R1.1 v55.88,82.8
GH_B  (via drill 0.6)
  Top 0.254: U1.42 38.86,52.07 39.88,53.09 42.16,53.09 42.42,53.34 42.42,54.86 42.67,55.12 46.23,55.12 46.99,55.88
  Top 0.406: 46.99,55.88 51.05,55.88 52.83,57.66 56.64,57.66 v57.4,56.9
  Bottom 0.406: R4.1 v57.4,56.9
GH_C  (via drill 0.6)
  Top 0.254: U1.37 38.56,49.58 39.88,48.26 41.91,48.26 43.94,46.23 43.94,40.64 44.45,40.13 46.23,40.13 46.74,39.62 46.74,32 47.24,31.5 v55.37,31.5
  Bottom 0.254: v55.37,31.5 R7.1
GL_A  (via drill 0.6)
  Top 0.254: U1.45 37.06,53.57 39.12,55.63 45.97,55.63 46.99,56.64
  Top 0.406: v51.56,57.91 51.56,57.4 50.8,56.64 46.99,56.64
  Bottom 0.406: R2.1 52.58,58.93 v51.56,57.91
GL_B  (via drill 0.6)
  Top 0.254: U1.40 43.92,51.08 44.45,50.55 44.45,40.89 44.7,40.64 v50.55,40.64
  Bottom 0.508: R5.1 51.05,33.27 50.8,33.53 50.8,40.39 v50.55,40.64
GL_C  (via drill 0.6)
  Top 0.254: v49.53,19.3 49.53,23.37 49.02,23.88 44.2,23.88 43.43,24.64 43.43,39.62 42.93,40.13 42.93,45.21 42.16,45.97 39.88,45.97 37.29,48.56 U1.35
  Bottom 0.406: R8.1 47.24,9.14 45.72,10.67 45.72,18.54 46.48,19.3 v49.53,19.3
GND  (via drill 0.6, 0.8)
  Top 0.254: 31.57,48.08 31.5,48.01 | 27.94,45.47 27.84,45.57 U1.28 | U1.31 34.95,46.58 35.31,46.23 35.31,44.7 35.56,44.45 37.34,44.45 37.59,44.2 37.59,43.25 C6.2 41.4,43.18 41.91,42.67 41.91,40.64 v40.89,39.62 | U1.33 35.99,47.57 v36.83,46.74 | v33.78,70.61 41.91,70.61 v42.42,70.1 | U2.31 30.94,30.43 31.24,30.73 v31.24,31.5 | U2.18 31.19,23.93 v31.5,23.62 | U2.47 20.63,33.98 20.07,34.54 v19.56,34.54 | C29.1 11.18,15.68 11.18,14.22 v11.43,13.97 | LED1.C 16.76,24.67 16.76,24.13 17.02,23.88 17.07,23.93 U2.63 | U1.34 37.01,48.08 39.62,45.47 41.91,45.47 42.42,44.96 42.42,39.88 42.93,39.37 42.93,24.38 43.94,23.37 47.75,23.37 48.51,22.61 v48.51,17.27 | U2.12 25.63,18.57 v26.16,18.03 | C30.1 23.05,12.77 v23.11,12.7
  Top 0.406: R14.1 C9.2 60.2,24.89 | R12.1 61.72,52.07 | C8.2 60.71,50.04 | C7.2 R10.1 58.61,64.33 58.67,64.26 | R16.1 C10.2 48.51,12.7 | C18.1 32,64.26 | 30.99,41.91 31.88,41.02 C12.1 32.83,40.95 C11.1 | J1.5 2,32.74 1.78,32.51 1.78,28.7 R32.2
  Top 0.508: C16.1 v21.84,40.64 | R20.1 v17.53,56.9 | R18.1 19.75,68.58 18.54,68.58 17.55,69.57 IC1.1 17.37,69.52 C27.- 17.27,66.95 17.27,65.79 16.7,65.21 C28.2
  Top 0.61: 12.45,25.65 v12.45,27.69
  Top 0.762: C15.1 33.22,62.93 C18.1 | 14.73,51.82 C19.1 16,50.42 v16,50.29 | 16.76,64.52 v16.76,62.23
  Bottom 0.254: C1.2 36.13,47.43 v36.83,46.74 36.07,47.5 33.78,47.5 33.78,48.77 34.54,49.53 34.54,64.52 33.78,65.28 v33.78,70.61 | v42.42,70.1 43.69,68.83 43.69,64.52 44.46,63.75 R3.2 | v19.56,34.54 19.56,33.78 | v11.43,13.97 12.19,13.97 | v40.89,39.62 43.94,39.62 44.2,39.37 44.2,38.61 44.45,38.35 R6.2
  Bottom 0.61: 12.7,28.45 12.95,28.7
  other vias: 29.97,43.69 48.51,58.42 49.78,59.69 48.51,60.96 49.78,62.23 49.78,64.01 48.26,33.02 49.53,34.29 48.26,35.56 49.53,36.83 49.28,38.35 50.55,17.27 50.55,14.22 48.51,14.22 49.53,15.75 27.94,66.04 29.46,66.04 27.94,64.77 29.46,64.77 9.14,18.54 1.52,28.7 9.14,20.07 9.14,21.59 9.14,23.11 9.14,24.64 9.14,26.16 32.77,21.59 32.77,26.16 32.77,24.64 32.77,23.11
  pour Top: 27.43,59.44 27.43,41.66 32,41.66 32,59.44
  pour Bottom: 44.96,66.04 50.55,66.04 50.55,57.66 44.96,57.66
  pour Top: 47.5,64.77 68.33,64.77 68.33,8.13 47.75,8.13 47.75,18.54 59.94,18.54 59.94,32.26 47.5,32.26 47.5,39.88 59.94,39.88 59.94,57.66 47.5,57.66
  pour Bottom: 44.96,39.88 50.04,39.88 50.04,32.26 44.96,32.26
  pour Bottom: 55.12,10.67 55.12,18.54 47.75,18.54 47.75,10.67
  cutout Bottom: 35.56,47.5 37.59,47.5 37.59,44.96 35.56,44.96
  cutout Bottom: 40.39,42.42 41.91,42.42 41.91,38.61 40.39,38.61
  pour Top: 24.13,71.63 24.13,68.33 25.4,68.33 25.4,62.23 30.48,62.23 30.48,63.25 32.77,63.25 32.77,67.56 28.45,67.56 28.45,71.63
  pour Top: 19.05,69.34 19.05,67.56 22.61,67.56 22.61,68.07 26.92,68.07 26.92,71.63 23.88,71.63 23.88,69.34
  pour Bottom (rank 4): 33.27,6.1 33.27,44.2 32.26,45.21 32.26,48.77 33.53,50.04 33.53,64.01 32.77,64.77 32.77,69.09 32.26,69.6 31.75,69.6 31.24,70.36 31.24,70.87 32.51,72.39 33.27,72.39 33.27,82.3 1.27,82.3 1.27,6.1
  pour Top: 16.76,26.67 16.76,24.64 10.41,24.64 9.91,24.13 9.91,18.29 11.94,16.51 11.94,13.46 10.16,13.46 10.16,16.51 8.38,18.29 8.38,26.16 8.89,26.67
  pour Top: 4.06,38.35 0.76,38.35 0.76,27.69 3.81,27.69 3.81,31.75 2.54,31.75 2.54,36.07 4.06,36.07
  pour Top: 32.51,20.57 38.1,20.57 41.15,17.53 41.15,14.48 41.4,14.22 49.02,14.22 49.28,14.48 49.28,18.29 49.02,18.54 46.23,18.54 40.64,24.13 40.89,37.34 40.13,38.1 33.53,38.1 33.53,42.16 33.27,42.42 27.43,42.42 27.43,40.64 28.96,39.12 28.96,35.81 29.46,35.31 31.5,35.31 32.77,34.04 32.77,29.46 32.26,28.96 32.26,20.83
INH_A  (via drill 0.6)
  Top 0.254: U1.17 21.61,51.08 17.53,46.99 17.53,44.7 v17.02,44.2 | U2.43 22.63,35.54 v21.46,36.7
  Bottom 0.254: v17.02,44.2 17.02,41.15 v21.46,36.7
INH_B  (via drill 0.6)
  Top 0.254: U1.19 22.12,50.06 18.54,46.48 18.54,42.93 v18.03,42.42 | 23.11,36.32 v22.86,36.58 23.13,36.31 U2.42
  Bottom 0.254: v18.03,42.42 18.03,41.15 19.3,39.88 19.56,39.88 v22.86,36.58
INH_C  (via drill 0.6)
  Top 0.254: U1.21 22.66,49.07 19.56,45.97 v19.56,41.15 | U2.41 23.63,36.07 v24.13,36.58
  Bottom 0.254: v24.13,36.58 v19.56,41.15
INL_A
  Top 0.254: U1.18 21.87,50.57 18.03,46.74 18.03,43.94 17.02,42.93 17.02,41.4 19.81,38.61 25.4,38.61 26.13,37.88 U2.36
INL_B
  Top 0.254: U1.20 22.4,49.58 19.05,46.23 19.05,42.16 18.54,41.66 18.54,40.64 20.07,39.12 25.65,39.12 26.63,38.14 U2.35
INL_C
  Top 0.254: U1.22 22.91,48.56 20.57,46.23 20.57,40.13 21.08,39.62 25.91,39.62 27.13,38.41 U2.34
N$1
  Top 0.254: U1.15 21.08,52.07 18.8,49.78 17.78,49.78 15.49,47.5 14.67,47.5 C23.2
N$2  (1 unrouted)
  Top 0.254: U1.14 20.83,52.58 18.54,50.29 17.53,50.29 16.51,49.28 14.92,49.28
N$3
  Top 0.254: U1.7 22.91,56.08 22.1,56.9 R20.2
N$4  (via drill 0.6)
  Top 0.254: U1.3 24.49,58.06 21.59,60.96 v21.34,60.96
  Top 1.016: R17.1 v19.81,72.39 R18.2
  Bottom 0.254: v19.81,72.39 19.81,62.48 v21.34,60.96
N$5
  Top 0.254: U1.56 33.5,59.72 33.27,59.94 29.28,59.94 C14.2
N$6
  Top 0.254: R19.2 25.91,59.11 U1.1
N$7
  Bottom 0.406: 59.12,80.79 D1.G 59.62,81.26 R1.2
N$8
  Bottom 0.254: 54.86,59.69 54.86,59.37 R2.2
  Bottom 0.406: 54.86,59.69 54.86,60.2 54.61,60.45 D2.G
N$9
  Bottom 0.406: 54.61,35.05 D4.G
  Bottom 0.762: R5.2 53.78,34.91 D4.G
N$10
  Bottom 0.508: D3.G 60.96,55.37 61.21,55.63 61.21,56.83 R4.2
N$11
  Bottom 0.406: R7.2 59.12,29.99 D5.G
N$12
  Bottom 0.406: R8.2 51.05,9.14 51.56,9.65 D6.G
N$13
  Top 0.254: U1.48 36.02,55.07 39.88,58.93 40.71,58.93 C22.2
N$14
  Top 0.254: U1.43 38.61,52.58 40.13,54.1 41.08,54.1 C21.2
N$15
  Top 0.254: U1.38 40.04,50.06 C20.2
N$16
  Top 0.254: U1.52 34.47,57.07 35.81,58.42 36.83,58.42 37.08,58.67 37.08,64.52 36.58,65.02 34.36,65.02 C17.2
N$17
  Top 0.254: U1.13 20.32,53.09 20.07,52.83
  Top 0.762: 20.07,52.83 19.05,51.82 C19.2
N$18
  Top 0.254: U1.23 23.19,48.08 21.84,46.74 C16.2
N$19
  Top 0.254: U1.27 24.99,46.08 24.64,45.72 24.64,43.94 24.89,43.69 C13.2
N$20
  Top 0.254: U1.2 24.99,58.57 23.88,59.69 R21.2
  Top 0.508: C24.1 22.86,66.8 22.61,66.55 22.61,60.96 22.86,60.71 23.81,60.71 R21.2
N$21
  Top 0.508: R21.1 23.88,64.7 C25.1
N$22
  Top 0.406: J1.4 6.49,33.39 6.86,33.02 6.86,28.89 6.67,28.7 R32.1
N$23
  Top 0.406: R29.1 7.94,32.77 R31.1 7.62,33.53 7.11,34.04 J1.3
N$24
  Top 0.406: R30.1 7.87,35.56 7,34.69 J1.2
N$25
  Top 0.406: R28.1 7.43,36.13 6.63,35.34 J1.1
N$28
  Top 0.254: U2.4 21.63,19.85 19.05,17.27 11.94,17.27 11.18,18.03 R27.2
N$29
  Top 0.254: U2.3 21.13,20.11 18.8,17.78 14.22,17.78 13.46,18.54 R26.2
N$30
  Top 0.254: 15.75,20.07 R25.2 15.75,19.05 16.51,18.29 18.54,18.29 20.63,20.37 U2.2
N$31
  Top 0.254: R25.1 LED1.A
N$32
  Top 0.254: R26.1 LED2.A
N$33
  Top 0.254: R27.1 LED3.A
N$35
  Top 0.254: U2.6 22.61,21.26 22.61,19.3 21.84,18.54 21.84,15.17 C30.2 21.09,14.92 X1.1
N$36
  Top 0.254: U2.5 22.13,19.59 21.34,18.8 21.34,16.51 20.83,16 18.03,16 17.27,15.24 17.27,13.21 16.51,12.45 15.44,12.45 X1.3 13.9,12.52 13.21,13.21 13.21,15.68 C29.2
N$39
  cutout Top: 20.57,30.23 21.08,30.73 26.42,30.73 26.92,30.23 26.92,24.13 26.42,23.62 21.08,23.62 20.57,24.13
NRST
  Top 0.254: SV1.5 20.57,10.92 21.08,11.43 23.62,11.43 24.13,11.94 24.13,13.21 23.62,13.72 23.11,13.72 22.61,14.22 22.61,15.75 22.35,16 22.35,18.29 23.11,19.05 23.11,21.27 U2.7
PH_A  (via drill 0.6)
  Top 0.254: U1.46 36.8,54.08 39.88,57.15 40.83,57.15 C22.1 41.98,57.22 42.67,57.91 42.67,67.31 43.69,68.33 47.5,68.33
  Top 0.406: v60.96,71.12 R9.2 59.18,71.31 59.18,72.14 58.67,72.64 56.64,72.64 55.88,71.88 55.88,69.85 54.36,68.33 47.5,68.33
  Bottom 0.406: v60.96,71.12 61.98,71.12 62.23,70.87
  pour Bottom: 68.33,79.76 57.66,79.76 57.66,58.93 68.33,58.93
PH_B  (via drill 0.6)
  Top 0.254: U1.41 39.62,51.56 40.13,52.07 41.08,52.07 C21.1 | 57.34,46.55 57.27,46.48 54.36,46.48 54.1,46.74 54.1,51.56 53.53,52.14 C21.1 | C21.1 40.89,52.14
  Top 0.406: R11.2 57.34,46.55 v57.91,45.97
  Bottom 0.406: v57.91,45.97 59.18,45.97
  pour Bottom: 68.33,54.36 57.66,54.36 57.66,33.53 68.33,33.53
PH_C  (via drill 0.6)
  Top 0.254: U1.36 38.05,49.07 39.88,47.24 40.83,47.24 C20.1 42.1,47.31 43.43,45.97 43.43,40.39 44.2,39.62 45.72,39.62 46.23,39.12 46.23,31.75 46.99,30.99 53.59,30.99 54.1,30.48 v54.1,20.32
  Top 0.406: R13.2 57.66,22.86 v57.66,21.08
  Bottom 0.254: 57.91,20.32 57.91,20.83 58.17,21.08 | v54.1,20.32 54.86,21.08 v57.66,21.08
  Bottom 0.406: v57.66,21.08 58.17,21.08 59.18,21.08
  pour Bottom: 68.33,28.96 57.66,28.96 57.66,8.13 68.33,8.13
RFM_CE  (via drill 0.6)
  Top 0.254: v25.65,14.99 25.65,16.51 24.63,17.54 U2.10
  Bottom 0.254: U3.3 5.59,59.94 6.1,59.44 6.1,39.12 7.87,37.34 7.87,27.94 7.11,27.18 7.11,17.02 7.87,16.26 7.87,7.11 8.89,6.1 25.15,6.1 26.16,7.11 26.16,14.48 v25.65,14.99
RFM_IRQ  (via drill 0.6)
  Top 0.254: v12.7,61.47 7.87,61.47 v7.11,60.71 | U2.8 23.63,18.55 23.37,18.29 23.37,15.24 v23.62,14.99
  Bottom 0.254: U3.8 11.94,62.23 v12.7,61.47 | v7.11,60.71 7.11,39.62 8.89,37.85 8.89,27.43 8.13,26.67 8.13,17.53 8.89,16.76 8.89,7.62 9.4,7.11 24.64,7.11 25.15,7.62 25.15,13.46 v23.62,14.99
RFM_NCS  (via drill 0.6)
  Top 0.254: U2.9 24.13,16.77 v24.64,16.26
  Bottom 0.254: U3.4 6.86,61.98 6.1,61.21 6.1,60.2 6.6,59.69 6.6,39.37 8.38,37.59 8.38,27.69 7.62,26.92 7.62,17.27 8.38,16.51 8.38,7.37 9.14,6.6 24.89,6.6 25.65,7.37 25.65,13.72 24.64,14.73 v24.64,16.26
SN_A  (via drill 0.6)
  Top 0.254: v32.26,70.61 33.27,71.63 43.69,71.63 43.94,71.37 v43.94,70.1 | U1.32 35.48,47.07 35.81,46.74 35.81,46.23 36.58,45.47 v36.83,45.47 | U1.44 37.85,53.09 v39.37,54.61 | v43.18,56.64 43.18,66.8 43.69,67.31 47.5,67.31
  Top 0.406: v50.04,67.31 47.5,67.31
  Bottom 0.254: C1.1 32.95,45.53 32.77,45.72 32.77,48.51 34.04,49.78 34.04,64.26 33.27,65.02 33.27,69.6 v32.26,70.61 | v39.37,54.61 40.39,55.63 42.16,55.63 v43.18,56.64 | 47.24,69.35 44.7,69.35 v43.94,70.1
  Bottom 0.406: R3.1 47.24,69.35 49.78,69.35 50.04,69.09 v50.04,67.31
  Bottom 0.508: C1.1 36.76,45.53 v36.83,45.47
  pour Bottom: 55.37,61.47 55.37,70.61 44.96,70.61 44.96,67.06 51.56,67.06 51.56,61.47
SN_B  (via drill 0.6)
  Top 0.254: U1.39 42.65,50.57 43.43,49.78 v43.43,48.01 | v40.89,41.4 36.32,41.4 35.63,42.1 C6.1 34.8,44.01 34.8,45.97 34.7,46.08 U1.30
  Bottom 0.254: R6.1 | 46.74,41.91 R6.1 | v43.43,48.01 43.43,45.97 44.2,45.21 44.2,43.94 44.45,43.69 | v40.89,41.4 43.94,41.4 44.2,41.66 44.2,43.43 44.45,43.69 | 44.45,43.69 46.48,43.69 R6.1
  Bottom 0.305: 45.47,44.45 46.23,44.45 R6.1
  pour Bottom: 55.37,36.07 55.37,45.21 44.96,45.21 44.96,41.66 51.56,41.66 51.56,36.07
SSENSE  (via drill 0.6)
  Top 0.254: U2.11 25.13,17.8 26.67,16.26 26.67,10.67 v28.19,9.14
  Top 0.406: R16.2 C10.1 44.2,12.63 | v35.56,7.37 32.77,7.37 | D10.A 32.77,7.37 | 32.77,7.37 v32.77,9.14
  Top 0.508: R15.1 44.2,10.73 R16.2 44.2,10.6 v44.2,8.38
  Bottom 0.406: v44.2,8.38 36.07,8.38 35.56,7.87 v35.56,7.37 | v32.77,9.14 v28.19,9.14
SUPPLY  (via drill 0.6)
  Top 0.254: U1.54 34.7,58.06 | U1.53 34.21,57.58 34.7,58.06 | U1.29 33.5,43.97 33.53,43.94 | C11.2 34.73,41.47 v34.54,41.66 34.04,42.16 34.04,43.69 33.78,43.94 33.53,43.94 | 34.7,58.06 35.81,59.18 | 33.53,43.94 32.89,43.94 C12.2
  Top 0.406: 32.77,43.97 C12.2
  Top 0.508: v43.94,14.22 42.42,14.22 42.16,13.97 R15.2
  Top 0.762: C15.2 32.32,61.03 C18.2
  Bottom 0.254: v34.54,41.66 35.05,41.66 35.31,41.4
  Bottom 0.406: C5.1 41.4,60.96 | C2.1 41.15,58.42 | C3.1 C4.1 43.56,30.86 43.43,30.73
  other vias: 36.07,59.69 36.07,61.21 36.07,62.74
  pour Bottom: 44.2,9.14 34.29,9.14 34.29,82.3 52.58,82.3 52.58,71.63 41.66,71.63 41.66,56.9 52.58,56.9 52.58,46.23 41.91,46.23 41.91,31.5 52.58,31.5 52.58,20.83 44.2,20.83
  pour Top: 33.78,61.47 35.05,61.47 35.31,61.72 35.31,63.75 35.56,64.01 36.58,64.01 36.83,63.75 36.83,59.18 36.58,58.93 35.56,58.93 35.31,59.18 35.31,59.44 35.05,59.69 34.04,59.69 33.78,59.94
SWCLK  (via drill 0.6)
  Top 0.254: SV1.2 12.95,11.94 12.45,12.45 9.65,12.45 9.14,12.95 9.14,16 7.37,17.78 7.37,26.67 8.38,27.69 10.16,27.69 11.18,28.7 11.18,30.99 v12.19,32 | U2.49 17.98,32.32 17.27,33.02 v17.27,34.54
  Bottom 0.254: 16.76,34.54 v17.27,34.54 13.72,34.54 13.21,34.04 13.21,33.02 v12.19,32
SWDIO  (via drill 0.6)
  Top 0.254: SV1.4 18.03,10.67 17.27,11.43 14.22,11.43 12.7,12.95 9.91,12.95 9.65,13.21 9.65,16.26 7.87,18.03 7.87,26.42 8.64,27.18 10.41,27.18 11.68,28.45 11.68,29.97 v12.19,30.48 | U2.46 21.13,34.25 19.81,35.56 v18.54,35.56
  Bottom 0.254: v18.54,35.56 18.54,38.35 17.02,39.88 13.21,39.88 12.7,39.37 12.7,38.1 11.18,36.58 11.18,31.5 v12.19,30.48
USART3_RX  (via drill 0.6)
  Top 0.254: U2.30 31.71,29.93 v32.26,30.48
USART3_TX  (via drill 0.6)
  Top 0.254: U2.29 31.53,29.43 v32.26,28.7
USB_D+  (via drill 0.6)
  Top 0.254: R31.2 v12.19,33.53 | v17.27,36.07 17.78,36.58 19.56,36.58 21.63,34.51 U2.45
  Bottom 0.254: v12.19,33.53 12.19,34.04 13.21,35.05 13.21,35.56 13.72,36.07 v17.27,36.07
USB_D-  (via drill 0.6)
  Top 0.254: U2.44 22.13,34.77 19.81,37.08 17.78,37.08 v17.27,37.59 | R30.2 v12.19,35.56
  Bottom 0.254: v17.27,37.59 13.21,37.59 12.19,36.58 v12.19,35.56
VCC  (via drill 0.6)
  Top 0.254: U1.49 35.26,55.58 v35.81,56.13 | v35.05,72.9 35.05,80.01 34.29,80.77 16.76,80.77 v11.94,75.95 | U2.13 26.13,22.71 C39.2 | U2.19 28.24,24.43 28.19,24.38 | U2.32 28,30.93 27.94,30.99 | U2.48 20.13,31.49 20.07,31.43 | U2.64 19.5,23.43 19.56,23.37 | U2.1 20.13,22.67 20.32,22.86 | U1.24 24.21,47.57 23.11,46.48 23.11,41.91 24.89,40.13 26.16,40.13 27.69,38.61 27.69,35.05 28.19,34.54 28.45,34.54 28.7,34.29 28.7,33.27 v28.96,33.02 | 14.73,64.52 C28.1
  Top 0.406: D7.C D8.C D9.C D10.C 11.18,7.37 10.41,8.13 SV1.1
  Top 0.508: 14.22,71.88 14.12,71.78 C27.+ 14.22,66.95 14.22,67.06 v11.94,67.06 | 14.22,71.88 IC1.2 | IC1.4 14.22,71.88 | v4.83,57.4 8.13,57.4
  Top 0.61: R28.2 9.33,38.93 v8.64,39.62 | v9.91,29.21 9.91,31.43 R29.2
  Top 1.016: 14.22,66.95 14.22,65.09 C28.1 | 14.73,64.52 14.73,60.71 13.72,59.69 10.16,59.69 8.13,57.66 8.13,57.4 8.13,40.13 v8.64,39.62
  Bottom 0.254: v35.05,72.9 35.05,56.9 v35.81,56.13 | R22.2 R23.2 R24.2 8.64,45.72 8.45,45.91
  Bottom 0.406: v11.94,67.06 v11.94,75.95 | C41.1 35.05,74.68 v35.05,72.9
  Bottom 0.508: v4.83,57.4 4.25,57.98 4.25,64.45 U3.2 4.32,67.5 C40.1 | 27.94,26.92 27.94,30.73 27.18,31.5 25.91,31.5 C32.2 | 27.94,26.92 27.94,23.37 27.43,22.86 25.91,22.86 C39.2 | C34.2 27.87,26.99 27.94,26.92
  Bottom 0.61: C33.2 C36.2 C31.2 C32.2 | C39.2 C35.2 C38.2 | C37.2 11.43,22.93 | 11.43,22.93 11.24,22.93 10.41,22.1 SV1.1 10.41,8.89 | 11.43,22.93 10.41,23.94 10.41,28.19 9.91,28.7 v9.91,29.21 10.16,29.46 10.16,38.1 v8.64,39.62 8.64,45.72
  other vias: 17.78,20.83 19.05,20.83 17.78,19.56 30.23,33.02
  pour Top: 18.29,18.8 19.56,20.07 19.56,22.1 20.07,22.61 27.69,22.61 28.19,23.11 28.19,31.24 28.96,32 30.73,32 30.99,32.26 30.99,33.53 30.73,33.78 28.45,33.78 28.19,33.53 28.19,32.26 27.69,31.75 19.81,31.75 19.3,31.24 19.3,23.11 18.8,22.61 17.27,22.61 17.02,22.35 17.02,19.05 17.27,18.8
  pour Bottom (rank 2): 17.02,19.05 17.27,18.8 18.54,18.8 19.81,20.07 19.81,21.59 20.07,21.84 26.92,21.84 27.18,22.1 27.18,23.11 26.92,23.37 20.32,23.37 19.81,23.88 18.29,23.88 18.03,23.62 18.03,22.1 17.78,21.84 17.27,21.84 17.02,21.59
  pour Bottom: 27.18,31.5 27.43,31.5 28.19,32.26 28.19,33.27 28.7,33.78 30.48,33.78 30.99,33.27 30.99,32.26 30.73,32 29.21,32 27.94,30.73

### Text on the board
Top: skatemate-motorcontrol v0.2 | FHNW 2017 - p4 team 2 | Ω
Bottom: skatemate-motorcontrol v0.2 | FHNW 2017 - p4 team 2